# EAGLE design untitled (EAGLE 9.6.2)
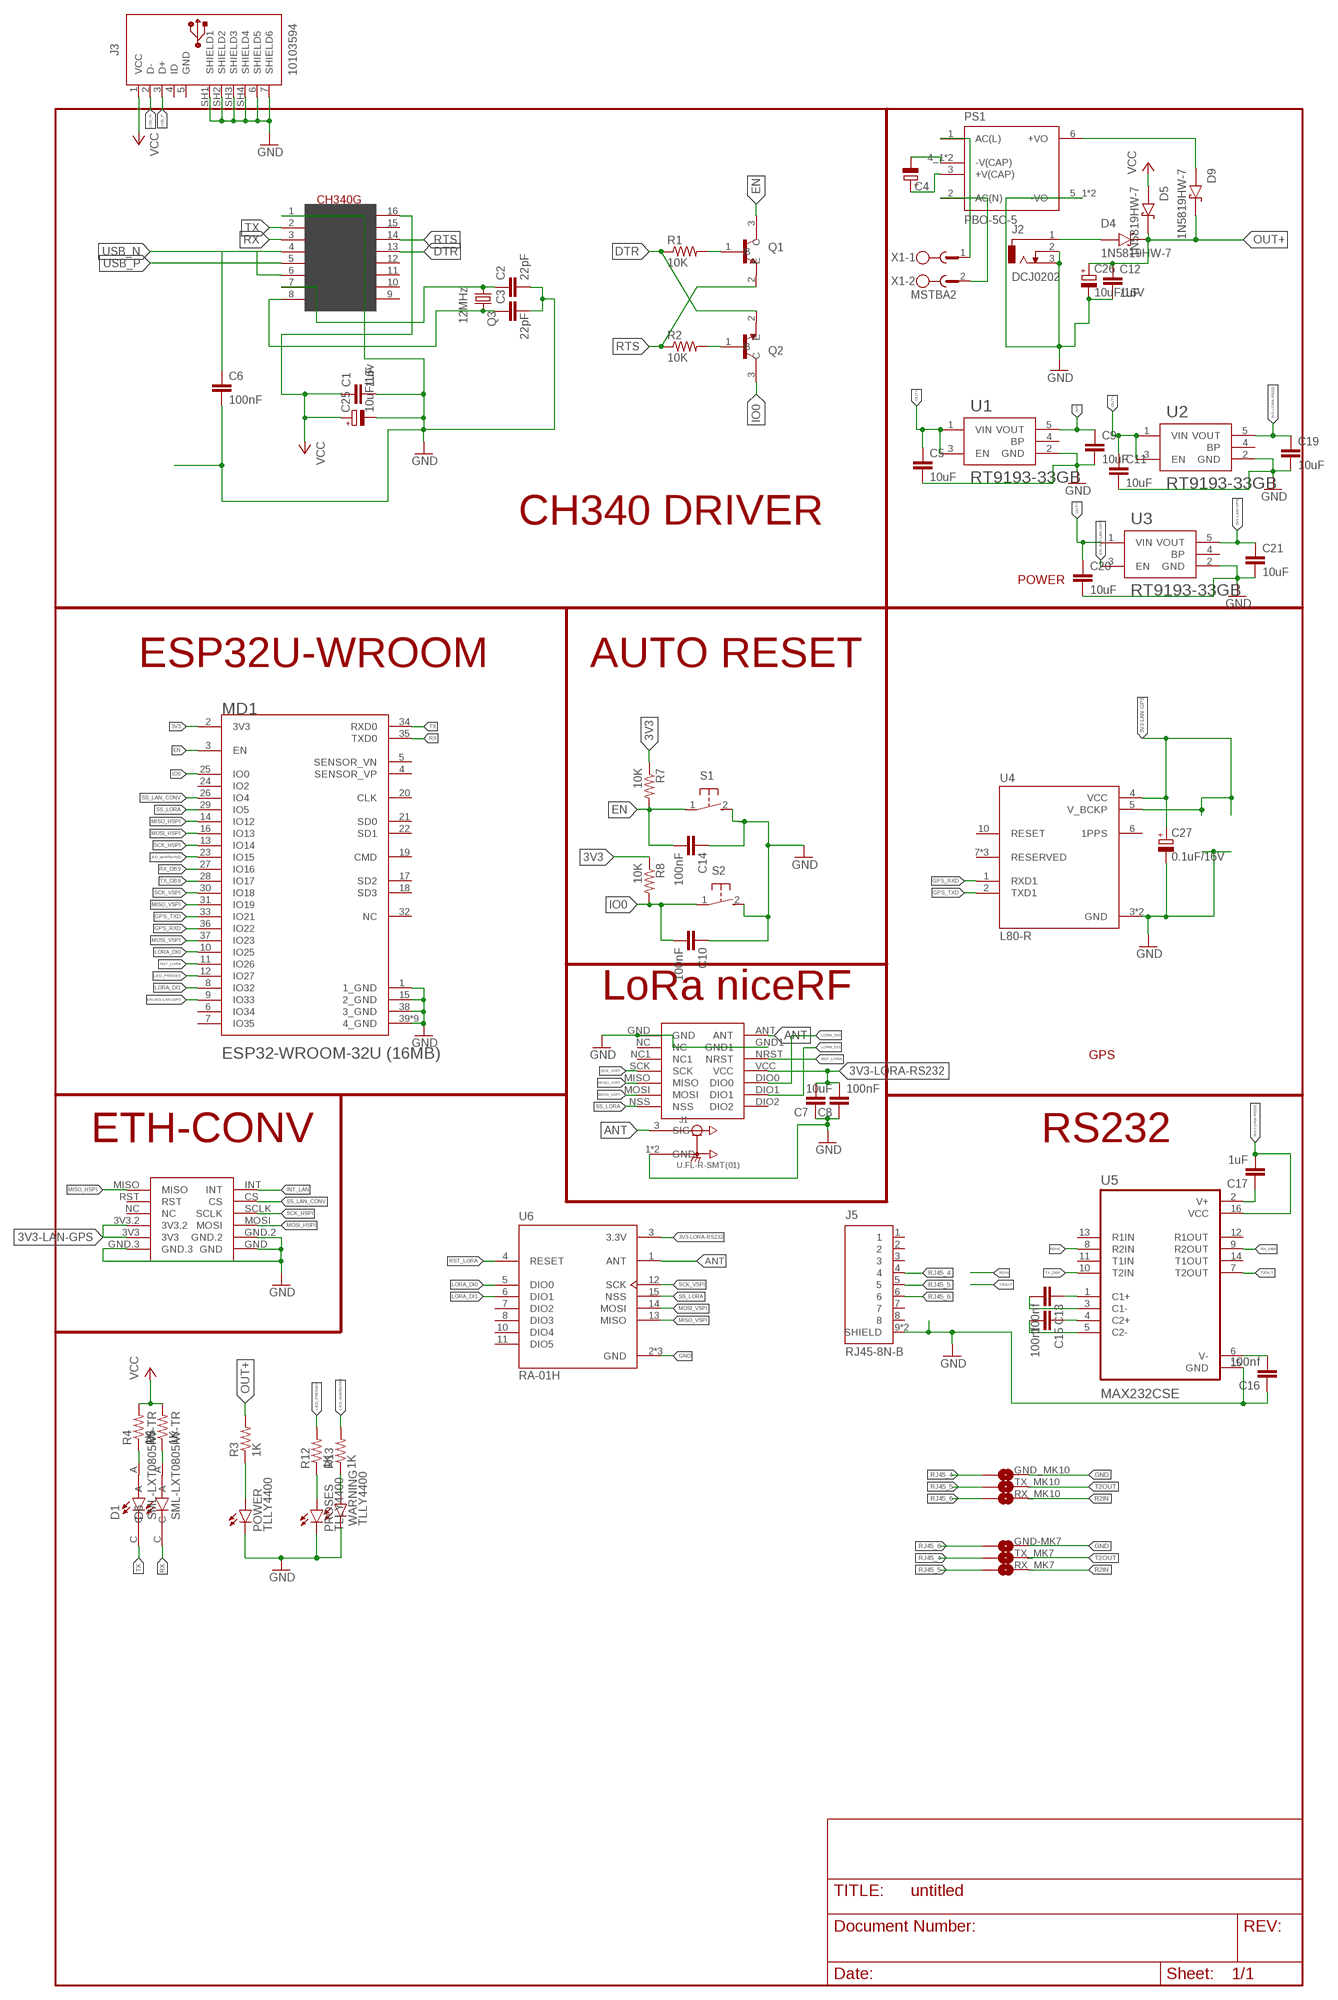
[diagram p0: schematic, sheet 1]

## Parts
C1  1uF  C-EUC0805K  [C0805K]
C2  22pF  C-EUC0805K  [C0805K]
C3  22pF  C-EUC0805K  [C0805K]
C4  CPOL-EUE2.5-7  [E2,5-7]
C5  10uF  C-EUC0805K  [C0805K]
C6  100nF  C-EUC0805K  [C0805K]
C7  10uF  C-EUC0805K  [C0805K]
C8  100nF  C-EUC0805K  [C0805K]
C9  10uF  C-EUC0805K  [C0805K]
C10  100nF  C-EUC0805K  [C0805K]
C11  10uF  C-EUC0805K  [C0805K]
C12  1uF  C-EUC0805K  [C0805K]
C13  100nf  C-EUC0805  [C0805]
C14  100nF  C-EUC0805K  [C0805K]
C15  100nf  C-EUC0805  [C0805]
C16  100nf  C-EUC0805  [C0805]
C17  1uF  C-EUC0805  [C0805]
C19  10uF  C-EUC0805K  [C0805K]
C20  10uF  C-EUC0805K  [C0805K]
C21  10uF  C-EUC0805K  [C0805K]
C25  10uF/16v  CPOL-EU153CLV-0505  [153CLV-0505]
C26  10uF/16V  CPOL-EU153CLV-0505  [153CLV-0505]
C27  0.1uF/16V  CPOL-EU153CLV-0505  [153CLV-0505]
D1  SML-LXT0805IW-TR  [LEDC2012X120N]
D4  1N5819HW-7  [SOD3715X145N]
D5  1N5819HW-7  [SOD3715X145N]
D6  SML-LXT0805IW-TR  [LEDC2012X120N]
D9  1N5819HW-7  [SOD3715X145N]
GND-MK7  1X02-SJ-NO  [1X02-SJ-NO]
GND_MK10  1X02-SJ-NO  [1X02-SJ-NO]
J1  U.FL-R-SMT(01)  [HRS_U.FL-R-SMT(01)]
J2  DCJ0202  [DCJ0202]
J3  10103594  [10103594]
J5  RJ45-8N-B  [TE_RJ45-8N-B]
LORA-NICERF-V1  LORA-NICERF-V2  [LORA-NICERF-V2]
MD1  ESPRESSIF_SYSTEMS_ESP32-WROOM-32U_16MBESPRESSIF_SYSTEMS_ESP32-WROOM-32U_16MB_0_0  [ESPRESSIF_SYSTEMS_ESP32-WROOM-32U_16MB_0]
POWER  TLLY4400  [LED3MM]
PROSES  TLLY4400  [LED3MM]
PS1  PBO-5C-5  [CONV_PBO-5C-5]
Q1  MMBT3904  [SOT95P240X120-3N]
Q2  MMBT3904  [SOT95P240X120-3N]
Q3  12MHz  CRYSTALSM49  [SM49]
R1  10K  R-US_M0805  [M0805]
R2  10K  R-US_M0805  [M0805]
R3  1K  R-US_M0805  [M0805]
R4  1K  R-US_M0805  [M0805]
R5  1K  R-US_M0805  [M0805]
R7  10K  R-US_M0805  [M0805]
R8  10K  R-US_M0805  [M0805]
R12  1K  R-US_M0805  [M0805]
R13  1K  R-US_M0805  [M0805]
RX_MK7  1X02-SJ-NO  [1X02-SJ-NO]
RX_MK10  1X02-SJ-NO  [1X02-SJ-NO]
S1  31-XX  [B3F-31XX]
S2  31-XX  [B3F-31XX]
TX_MK7  1X02-SJ-NO  [1X02-SJ-NO]
TX_MK10  1X02-SJ-NO  [1X02-SJ-NO]
U1  RT9193-33GB  [SOT94P279X129-5N]
U2  RT9193-33GB  [SOT94P279X129-5N]
U3  RT9193-33GB  [SOT94P279X129-5N]
U4  L80-R  [XCVR_L80-R]
U5  MAX232CSE  [SOIC127P600X175-16N]
U6  RA-01H  [XCVR_RA-01H]
U$2  CH340G  [SOIC16]
U$3  MINI_W5500  [MINI_W5500]
WARNING  TLLY4400  [LED3MM]
X1  MSTBA2  [MSTBA2]

## Nets
3V3: C9.1 MD1.2(3V3) R7.1 R8.1 U1.5(VOUT)
3V3-LAN-GPS: C21.1 C27.+ U3.5(VOUT) U4.4(VCC) U4.5(V_BCKP) U$3.3V3 U$3.3V3.2
3V3-LORA-RS232: C7.2 C8.2 C17.2 C19.1 LORA-NICERF-V1.VCC U2.5(VOUT) U5.16(VCC) U6.3(3.3V)
ANT: J1.3(SIG) LORA-NICERF-V1.ANT U6.1(ANT)
DTR: Q2.2(E) R1.1 U$2.13(DTR)
EN: C14.2 MD1.3(EN) Q1.3(C) R7.2 S1.1(P)
EN-3V3-LAN-GPS: MD1.9(IO33) U3.3(EN)
GND: C1.2 C2.2 C3.2 C5.2 C6.2 C7.1 C8.1 C9.2 C10.1 C11.2 C12.2 C14.1 C16.1 C19.2 C20.2 C21.2 C25.- C26.- C27.- GND-MK7.2 GND_MK10.2 J1.1(GND) J1.2(GND) J2.2 J2.3 J3.6(SHIELD5) J3.7(SHIELD6) J3.SH1(SHIELD1) J3.SH2(SHIELD2) J3.SH3(SHIELD3) J3.SH4(SHIELD4) J5.9(SHIELD) J5.10(SHIELD) LORA-NICERF-V1.GND LORA-NICERF-V1.GND1 MD1.1(1_GND) MD1.15(2_GND) MD1.38(3_GND) MD1.39(4_GND) MD1.39-2(4_GND) MD1.39-3(4_GND) MD1.39-4(4_GND) MD1.39-5(4_GND) MD1.39-6(4_GND) MD1.39-7(4_GND) MD1.39-8(4_GND) MD1.39-9(4_GND) POWER.K(C) PROSES.K(C) PS1.5_1(-VO) PS1.5_2(-VO) S1.2(S) S2.2(S) U1.2(GND) U2.2(GND) U3.2(GND) U4.3(GND) U4.12(GND) U5.15(GND) U6.2(GND) U6.9(GND) U6.16(GND) U$2.1(GND) U$3.GND U$3.GND.2 U$3.GND.3 WARNING.K(C)
GPS_RXD: MD1.36(IO22) U4.1(RXD1)
GPS_TXD: MD1.33(IO21) U4.2(TXD1)
INT_LAN: U$3.INT
IO0: C10.2 MD1.25(IO0) Q2.3(C) R8.2 S2.1(P)
LED_PROSES: MD1.12(IO27) R12.2
LED_WARNING: MD1.23(IO15) R13.2
LORA_DI0: LORA-NICERF-V1.DIO0 MD1.10(IO25) U6.5(DIO0)
LORA_DI1: LORA-NICERF-V1.DIO1 MD1.8(IO32) U6.6(DIO1)
MISO_HSPI: MD1.14(IO12) U$3.MISO
MISO_VSPI: LORA-NICERF-V1.MISO MD1.31(IO19) U6.13(MISO)
MOSI_HSPI: MD1.16(IO13) U$3.MOSI
MOSI_VSPI: LORA-NICERF-V1.MOSI MD1.37(IO23) U6.14(MOSI)
N$1: C2.1 Q3.1 U$2.7(XI)
N$2: C3.1 Q3.2 U$2.8(XO)
N$3: POWER.A R3.1
N$4: Q1.1(B) R1.2
N$5: Q2.1(B) R2.2
N$6: D4.A J2.1
N$7: C4.- PS1.4_1(-V(CAP)) PS1.4_2(-V(CAP))
N$8: D1.A R4.1
N$9: D6.A R5.1
N$10: C13.1 U5.1(C1+)
N$11: C4.+ PS1.3(+V(CAP))
N$12: C6.1 U$2.4(V3)
N$13: PS1.1(AC(L)) X1.1
N$14: C13.2 U5.3(C1-)
N$15: PS1.2(AC(N)) X1.2
N$16: D9.A PS1.6(+VO)
N$19: C15.1 U5.4(C2+)
N$24: C15.2 U5.5(C2-)
N$25: PROSES.A R12.1
N$26: C17.1 U5.2(V+)
N$27: C16.2 U5.6(V-)
N$28: R13.1 WARNING.A
OUT+: C5.1 C11.1 C12.1 C20.1 C26.+ D4.C(K) D5.C(K) D9.C(K) R3.2 U1.1(VIN) U1.3(EN) U2.1(VIN) U2.3(EN) U3.1(VIN)
R2IN: RX_MK7.2 RX_MK10.2 U5.8(R2IN)
RJ45_4: GND_MK10.1 J5.4 TX_MK7.1
RJ45_5: J5.5 RX_MK7.1 TX_MK10.1
RJ45_6: GND-MK7.1 J5.6 RX_MK10.1
RST_LORA: LORA-NICERF-V1.NRST MD1.11(IO26) U6.4(RESET)
RTS: Q1.2(E) R2.1 U$2.14(RTS)
RX: D6.C MD1.35(TXD0) U$2.3(RX)
RX_DB9: MD1.27(IO16) U5.9(R2OUT)
SCK_HSPI: MD1.13(IO14) U$3.SCLK
SCK_VSPI: LORA-NICERF-V1.SCK MD1.30(IO18) U6.12(SCK)
SS_LAN_CONV: MD1.26(IO4) U$3.CS
SS_LORA: LORA-NICERF-V1.NSS MD1.29(IO5) U6.15(NSS)
T2OUT: TX_MK7.2 TX_MK10.2 U5.7(T2OUT)
TX: D1.C MD1.34(RXD0) U$2.2(TX)
TX_DB9: MD1.28(IO17) U5.10(T2IN)
USB_N: J3.2(D-) U$2.6(D-)
USB_P: J3.3(D+) U$2.5(D+)
VCC: C1.1 C25.+ D5.A J3.1(VCC) R4.2 R5.2 U$2.16(VCC)
Unconnected: J3.4(ID) J5.1 J5.2 J5.3 J5.7 J5.8 LORA-NICERF-V1.DIO2 LORA-NICERF-V1.NC LORA-NICERF-V1.NC1 MD1.4(SENSOR_VP) MD1.5(SENSOR_VN) MD1.6(IO34) MD1.7(IO35) MD1.17(SD2) MD1.18(SD3) MD1.19(CMD) MD1.20(CLK) MD1.21(SD0) MD1.22(SD1) MD1.24(IO2) MD1.32(NC) U1.4(BP) U2.4(BP) U3.4(BP) U4.6(1PPS) U4.7(RESERVED) U4.8(RESERVED) U4.10(RESET) U4.11(RESERVED) U5.11(T1IN) U5.12(R1OUT) U5.13(R1IN) U5.14(T1OUT) U6.7(DIO2) U6.8(DIO3) U6.10(DIO4) U6.11(DIO5) U$2.9(CTS) U$2.10(DSR) U$2.11(RI) U$2.12(DCD) U$2.15(RS232) U$3.NC U$3.RST

## Notes on the sheet
- CH340 DRIVER
- POWER
- ESP32U-WROOM | AUTO RESET
- LoRa niceRF
- GPS
- ETH-CONV | RS232

## Power pins joined to a net without a drawn wire
GND: J3.5(GND)

## Library data of the parts
C1-C3 C5-C17 C19-C21 = rcl:C-EU: CAPACITOR, European symbol; SPICEPREFIX: C
C4 C25-C27 = rcl:CPOL-EU: POLARIZED CAPACITOR, European symbol; SPICEPREFIX: C
D1 D6 = SML-LXT0805IW-TR:SML-LXT0805IW-TR: LED; Luminous Intensity:11µcd; Viewing Angle:140°; Forward Current:30mA; Forward Voltage:2V; Color:Red; LED Color:Red; Leaded Process Compatible:Yes; Lens Color:White; Mounting Type:Surface Mount ;RoHS Compliant: Yes Check availability <https://pricing.snapeda.com/parts/SML-LXT0805IW-TR/Lumex%20Opto/Components/view-part?ref=eda>; AVAILABILITY: In Stock; DESCRIPTION: Red - LED Indication - Discrete 2V 0805 (2012 Metric); MF: Lumex Opto/Components; MP: SML-LXT0805IW-TR; PACKAGE: 0805 Lumex; PRICE: None; PURCHASE-URL: https://pricing.snapeda.com/search/part/SML-LXT0805IW-TR/?ref=eda
D4 D5 D9 = 1N5819HW-7:1N5819HW-7: 1N5819HW Series 40 V 1 A Surface Mount Schottky Barrier Rectifier - SOD-123 Check availability <https://pricing.snapeda.com/parts/1N5819HW-7/Diodes%20Inc./view-part?ref=eda>; AVAILABILITY: In Stock; DESCRIPTION: Diode Schottky 40 V 1A Surface Mount SOD-123; MF: Diodes Inc.; MP: 1N5819HW-7; PACKAGE: SOD-123 Fairchild Semiconductor; PRICE: None; PURCHASE-URL: https://pricing.snapeda.com/search/part/1N5819HW-7/?ref=eda
GND-MK7 GND_MK10 RX_MK7 RX_MK10 TX_MK7 TX_MK10 = Ai_Connectors:1X02-SJ-NO: A.I. Device 1x02-SJ-* NC has a large amount of paste (see paste layer) so that it should jumper during reflow. Remember that we have a version with a buil-in trace, which needs to be cut in order to have the jumper be NO.
J1 = U.FL-R-SMT_01_:U.FL-R-SMT(01): U.FL Series 6 Ghz 50 Ohm Ultra-small SMT Coaxial Cable Receptacle Check availability <https://pricing.snapeda.com/parts/U.FL-R-SMT%2801%29/Hirose/view-part?ref=eda>; AVAILABILITY: In Stock; DESCRIPTION: U.FL (UMCC) Connector Receptacle, Male Pin 50Ohm Surface Mount Solder. RF Connectors / Coaxial Connectors; MF: Hirose; MP: U.FL-R-SMT(01); PACKAGE: None; PRICE: None; PURCHASE-URL: https://pricing.snapeda.com/search/part/U.FL-R-SMT(01)/?ref=eda
J2 = con-jack:DCJ0202: DC POWER JACK Source: DCJ0202.pdf; OC_FARNELL: unknown; OC_NEWARK: unknown
J3 = Connector_USB:10103594: USB(2.0) Micro-B, RCPT, 5POS, SMD-THT-R/A Datasheet <https://cdn.amphenol-icc.com/media/wysiwyg/files/documentation/datasheet/inputoutput/io_usb_micro.pdf> Drawing <https://cdn.amphenol-icc.com/media/wysiwyg/files/drawing/10103594.pdf>; CATEGORY: Connectors; CONTACTS: 5; CURRENT-RATING: 1.8A; DESCRIPTION: CONN RCPT USB2.0 MICRO B SMD R/A; GENDER: Receptacle; MANUFACTURER: Amphenol ICC (FCI); MOUNT_TYPE: R/A; MPN: 10103594-0001LF; OPERATING_TEMPERATURE: -30°C ~ 80°C; PART_STATUS: ACTIVE; ROHS_COMPLIANT: COMPLIANT; SUB_CATEGORY: USB; TYPE: USB-micro B; VOLTAGE-RATING: 100VAC
J5 = RJ45-8N-B:RJ45-8N-B: RJ Jack / Signal Line EMI/RFI Filters 6 TERM LOW PROFILE BLOCK INDUCTOR 8 PIN Check availability <https://pricing.snapeda.com/parts/RJ45-8N-B/TE%20Connectivity/view-part?ref=eda>; AVAILABILITY: In Stock; DESCRIPTION: Jack Modular Connector 8p8c (RJ45, Ethernet) 90° Angle (Right) Unshielded -; MF: TE Connectivity; MP: RJ45-8N-B; PACKAGE: None; PRICE: None; PURCHASE-URL: https://pricing.snapeda.com/search/part/RJ45-8N-B/?ref=eda
LORA-NICERF-V1 = LORA-NICERF-V2:LORA-NICERF-V2
MD1 = Espressif Systems - ESP32-WROOM-32U (16MB):ESPRESSIF_SYSTEMS_ESP32-WROOM-32U_16MB: Bluetooth, WiFi 802.11b/g/n, Bluetooth v4.2 +EDR, Class 1, 2 and 3 Transceiver Module 2.4GHz ~ 2.5GHz Antenna Not Included, U.FL Surface Mount; AUTOMOTIVE: No; BANDWIDTH: 72MHz; CENTROID_NOT_SPECIFIED: No; DATASHEET: https://www.espressif.com/sites/default/files/documentation/esp32-wroom-32d_esp32-wroom-32u_datasheet_en.pdf; DATA_RATE: 150Mbits/s; DEVICE_CLASS_L1: Integrated Circuits (ICs); DEVICE_CLASS_L2: RF Semiconductors and Devices; DEVICE_CLASS_L3: Transceivers; DIGIKEY_DESCRIPTION: RX TXRX MODULE WIFI U.FL SMD; DIGIKEY_PART_NUMBER: 1904-1028-1-ND; FOOTPRINT_VARIANT_NAME_0: Recommended_Land_Pattern; HEIGHT: 3.35mm; INTERFACE: I2C,SPI,UART,Ethernet,I2S,Other; LEAD_FREE: Yes; MAX_FREQUENCY: 2484MHz; MAX_SUPPLY_VOLTAGE: 3.6V; MF: Espressif Systems; MFG_PACKAGE_IDENT: 0; MFG_PACKAGE_IDENT_DATE: 0; MFG_PACKAGE_IDENT_REV: 0; MIN_SUPPLY_VOLTAGE: 3V; MOUSER_PART_NUMBER: 356-ES32WROOM32U16MB; MPN: ESP32-WROOM-32U (16MB); NOMINAL_SUPPLY_CURRENT: 0.5A; NUMBER_OF_ADC_CHANNELS: 16; NUMBER_OF_GPIO: 26; PACKAGE: BT_MODULE; PREFIX: MD; ROHS: Yes; SENSITIVITY: -98dBm; TEMPERATURE_RANGE_HIGH: +85°C; TEMPERATURE_RANGE_LOW: -40°C; VERIFICATION_VERSION: 0.0.0.3
POWER PROSES WARNING = led:TLLY4400: Low Current (2mA) LED 3 mm Tinted Diffused Package color YELLOW Source: Data sheet <http://www.farnell.com/datasheets/391098.pdf>; MF: VISHAY SEMICONDUCTOR; OC_FARNELL: 1612439
PS1 = PBO-5C-5:PBO-5C-5: Check availability <https://pricing.snapeda.com/parts/PBO-5C-5/CUI/view-part?ref=eda>; AVAILABILITY: In Stock; CUI_PURCHASE_URL: https://www.cui.com/product/internal-ac-dc-power-supplies/board-mount/pbo-5c-series?utm_source=snapeda.com&utm_medium=referral&utm_campaign=snapedaBOM; DESCRIPTION: 5 W, 85 ~ 305 Vac Input, Single Output, Open Frame, Board Mount, Ac-Dc Power Supply; MF: CUI; MP: PBO-5C-5; PACKAGE: SIP-6 CUI; PRICE: None; PURCHASE-URL: https://pricing.snapeda.com/search/part/PBO-5C-5/?ref=eda
Q1 Q2 = MMBT3904:MMBT3904: MMBT3904 Series 40 V CE Breakdown 0.2 A NPN General Purpose Amplifier - SOT-23 Check availability <https://pricing.snapeda.com/parts/MMBT3904/STMicroelectronics/view-part?ref=eda>; AVAILABILITY: Not in stock; DESCRIPTION: SMD Transistor MMBT3904 SOT-23 SMD DIOTEC; MF: STMicroelectronics; MP: MMBT3904; PACKAGE: SOT-23 ON; PRICE: None
Q3 = adafruit:CRYSTAL: CRYSTAL; OC_FARNELL: unknown; OC_NEWARK: unknown
R1-R5 R7 R8 R12 R13 = adafruit:R-US_: RESISTOR, American symbol
S1 S2 = switch-omron:31-XX: OMRON SWITCH; MPN: B3F-3100; OC_FARNELL: 959704; OC_NEWARK: 36M3582
U1-U3 = RT9193-33GB:RT9193-33GB: RT9193 Series 300 mA 3.3 V Ultra-Low Noise Ultra-Fast CMOS LDO Regulator-SC-70-5 Check availability <https://pricing.snapeda.com/parts/RT9193-33GB/Richtek%20USA%20Inc./view-part?ref=eda>; AVAILABILITY: In Stock; DESCRIPTION: Linear Voltage Regulator IC Positive Fixed 1 Output 300mA SOT-23-5; MF: Richtek USA Inc.; MP: RT9193-33GB; PACKAGE: SOT-23-5 Richtek; PRICE: None; PURCHASE-URL: https://pricing.snapeda.com/search/part/RT9193-33GB/?ref=eda
U4 = L80-R:L80-R: Check availability <https://pricing.snapeda.com/parts/L80-R/Quectel/view-part?ref=eda>; AVAILABILITY: In Stock; DESCRIPTION: L80-R is an ultra compact GPS POT (Patch on Top) module with an embedded 15.0mm × 15.0mm × 4.0mm patch antenna; MF: Quectel; MP: L80-R; PACKAGE: None; PRICE: None
U5 = MAX232CSE:MAX232CSE: Check availability <https://pricing.snapeda.com/parts/MAX232CSE/Maxim%20Integrated/view-part?ref=eda>; AVAILABILITY: In Stock; DESCRIPTION: 2/2 Transceiver Full RS232 16-SOIC; MF: Maxim Integrated; MP: MAX232CSE; PACKAGE: SOIC-16 Maxim Integrated; PRICE: None; PURCHASE-URL: https://pricing.snapeda.com/search/part/MAX232CSE/?ref=eda
U6 = RA-01H:RA-01H: Ai-Thinker Lora Series Module Check availability <https://pricing.snapeda.com/parts/RA-01H/AI-Thinker/view-part?ref=eda>; AVAILABILITY: In Stock; DESCRIPTION: General ISM < 1GHz LoRa™ Transceiver Module 803MHz ~ 930MHz Antenna Not Included Surface Mount; MF: AI-Thinker; MP: RA-01H; PACKAGE: Package; PRICE: None; PURCHASE-URL: https://pricing.snapeda.com/search/part/RA-01H/?ref=eda
U$2 = usb-serial:CH340G
U$3 = ethernet-mikroavr:MINI_W5500: MINI ETHERNET W5500, CREATE BY MIKROAVR.COM
X1 = con-phoenix-508:MSTBA2: PHOENIX; MF: FARNELL; MPN: 1757242; OC_FARNELL: 3705171; OC_NEWARK: 71C4161

## Net classes
0 default: width 0.2 mm, clearance 0.15 mm

## Board
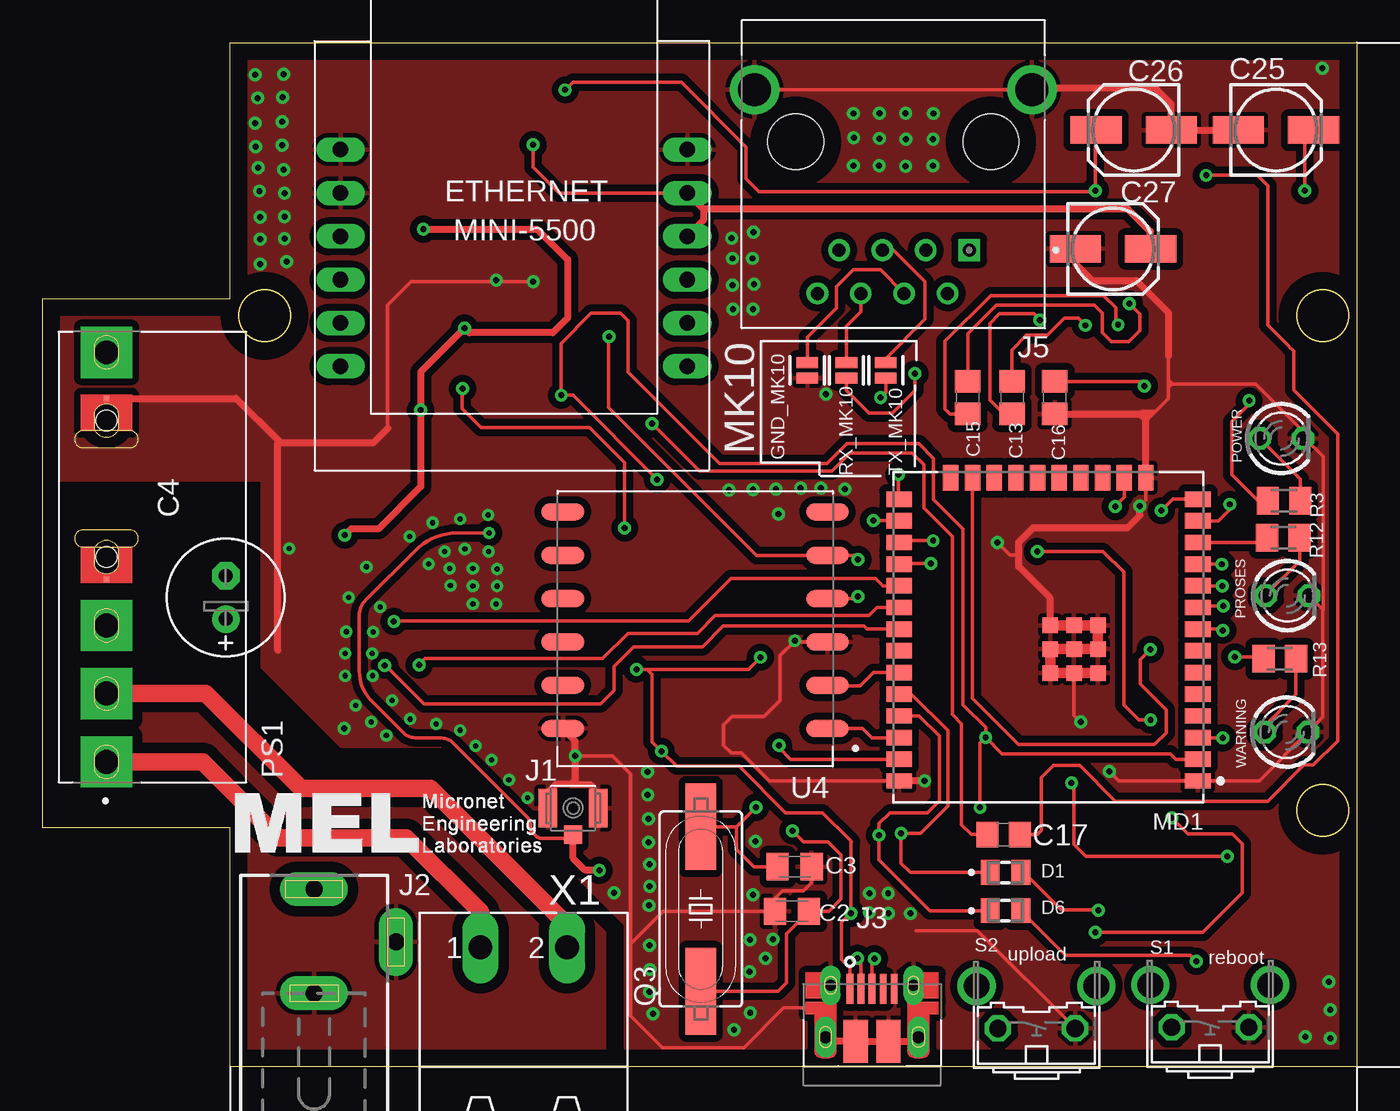
[diagram p1: board, top side]
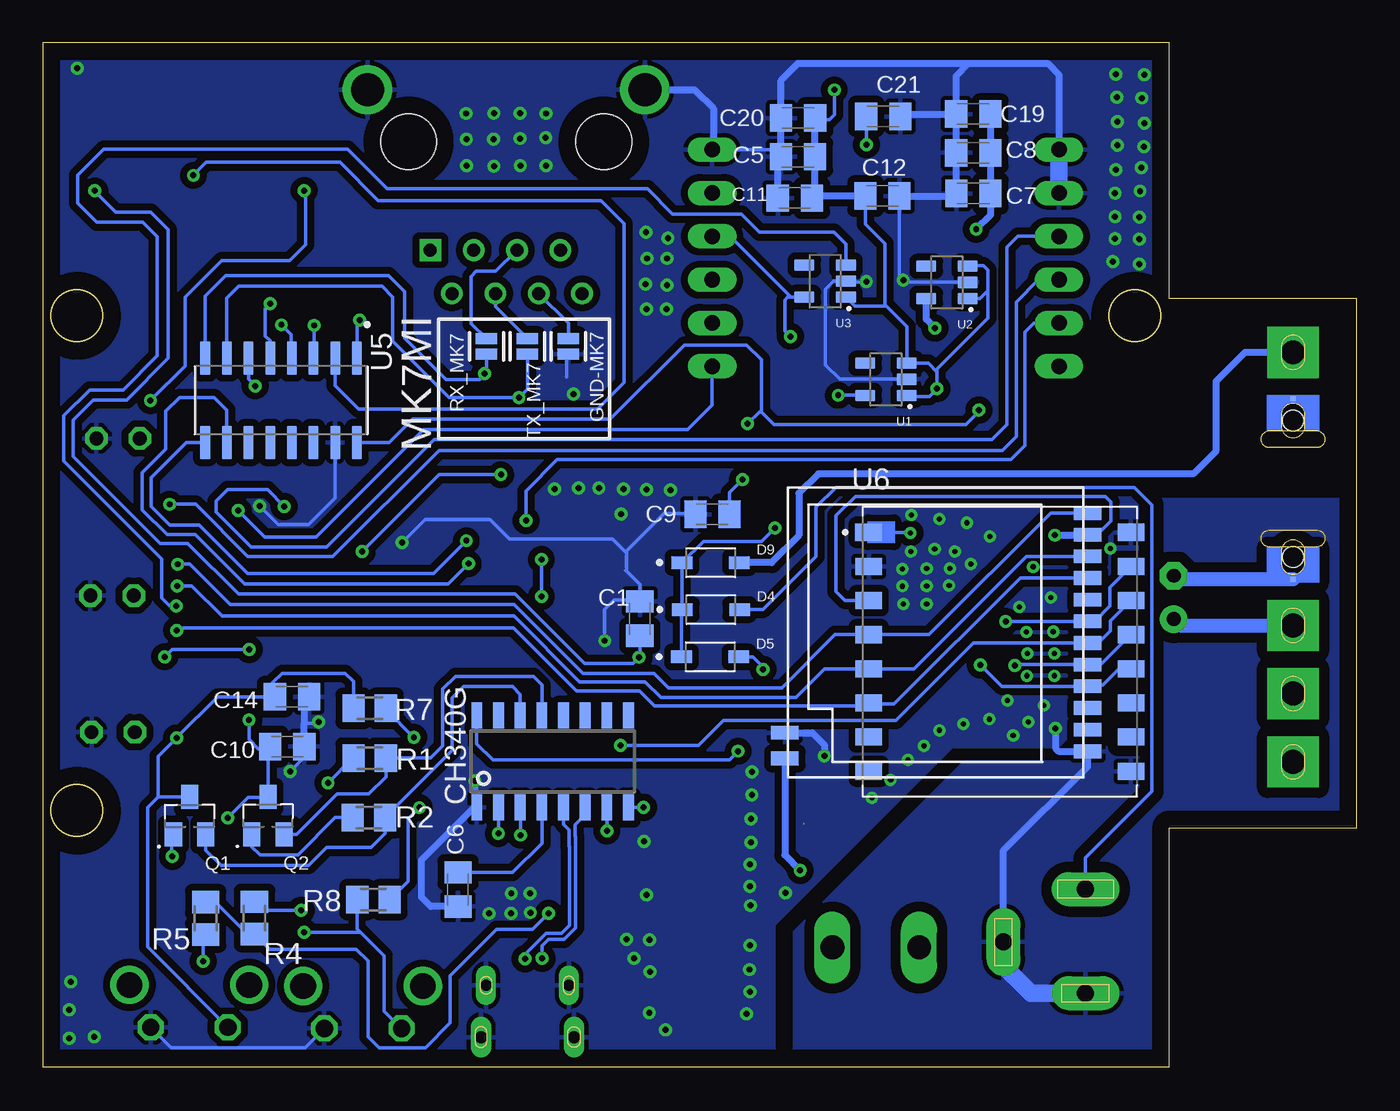
[diagram p2: board, bottom side, seen from below]

Size 77 x 60 mm. Coordinates in mm from the lower left corner, seen from the top.
Outline: 11,60 77,60 77,0 11,0 11,14 0,14 0,45 11,45 11,60
Outline: circle at 75,44 radius 1.5
Outline: circle at 13,44 radius 1.5
Outline: circle at 75,15 radius 1.5
Copper layers (1*16): Top 0.035mm / dielectric 1.5mm / Bottom 0.035mm
Design rules "default *": minimum track width 6mil, minimum drill 0.3mm, track to track 6mil, track to pad 6mil, pad to pad 6mil, via to via 6mil, smd to smd 6mil, copper to edge 40mil, drill to drill 6mil, minimum pad ring 10mil, minimum via ring 8mil, stop-mask expansion 4mil, vias tented up to drill 0mil, thermal gap 10mil

### Footprints (pad centres in the part's own frame; a part is rotated, then mirrored left to right if it is on the bottom)
C0805K = smd 1.3 x 1.6: 1 -1,0; 2 1,0
E2,5-7 = drill 0.813 pad 1.6: + -1.27,0 | drill 0.813 pad 1.6 octagon: - 1.27,0
C0805 = smd 1.3 x 1.5: 1 -0.95,0; 2 0.95,0
153CLV-0505 = smd 3 x 1.6: + 2.2,0; - -2.2,0
LEDC2012X120N = smd 1.1 x 1.45: A 0.9,0; C -0.9,0
SOD3715X145N = smd 1.21 x 0.73: A 1.68,0; C -1.68,0
1X02-SJ-NO = smd 0.635 x 1.27: 1 -0.45,0; 2 0.45,0
HRS_U.FL-R-SMT(01) = smd 1.1 x 2.25: 1 -1.475,0; 2 1.475,0 | smd 1.05 x 1.1: 3 0,-1.55
DCJ0202 = drill 1 pad 2 long: 1 0,3.1; 2 4.8,0; 3 0,-3
10103594 = smd 0.4 x 1.75: 1 -1.3,2.825; 2 -0.65,2.825; 3 0,2.825; 4 0.65,2.825; 5 1.3,2.825 | smd 1.425 x 2.5: 6 -0.963,-0.25; 7 0.963,-0.25 | drill 0.65 pad 0.73 long: SH1 -2.425,3.03; SH2 2.425,3.03 | drill 0.7 long: SH3 -2.725,0; SH4 2.725,0
TE_RJ45-8N-B = drill 0.76 square: 1 -4.445,6.35 | drill 0.76: 2 -3.175,8.89; 3 -1.905,6.35; 4 -0.635,8.89; 5 0.635,6.35; 6 1.905,8.89; 7 3.175,6.35; 8 4.445,8.89 | drill 1.93: 9 -8.125,-3.05; 10 8.125,-3.05 | hole 3.25: -5.715,0; 5.715,0
LORA-NICERF-V2 = smd 1.6 x 0.8: ANT 9.17,6.81; DIO0 -8.57,-5.03; DIO1 -8.57,-3.76; DIO2 -8.57,-2.49; GND -8.57,6.4; GND1 9.17,5.31; MISO -8.57,1.32; MOSI -8.57,0.05; NC -8.57,5.13; NC1 -8.57,3.86; NRST -8.57,-7.57; NSS -8.57,-1.22; SCK -8.57,2.59; VCC -8.57,-6.3
ESPRESSIF_SYSTEMS_ESP32-WROOM-32U_16MB_0 = smd 1.5 x 0.9: 1 -8.75,8.41; 2 -8.75,7.14; 3 -8.75,5.87; 4 -8.75,4.6; 5 -8.75,3.33; 6 -8.75,2.06; 7 -8.75,0.79; 8 -8.75,-0.48; 9 -8.75,-1.75; 10 -8.75,-3.02; 11 -8.75,-4.29; 12 -8.75,-5.56; 13 -8.75,-6.83; 14 -8.75,-8.1; 25 8.75,-8.1; 26 8.75,-6.83; 27 8.75,-5.56; 28 8.75,-4.29; 29 8.75,-3.02; 30 8.75,-1.75; 31 8.75,-0.48; 32 8.75,0.79; 33 8.75,2.06; 34 8.75,3.33; 35 8.75,4.6; 36 8.75,5.87; 37 8.75,7.14; 38 8.75,8.41 | smd 0.9 x 1.5: 15 -5.71,-9.35; 16 -4.44,-9.35; 17 -3.17,-9.35; 18 -1.9,-9.35; 19 -0.63,-9.35; 20 0.64,-9.35; 21 1.91,-9.35; 22 3.18,-9.35; 23 4.45,-9.35; 24 5.72,-9.35 | smd 0.9 x 0.9: 39 -2.9,2.09; 39-2 -1.5,0.69; 39-3 -1.5,2.09; 39-4 -0.1,2.09; 39-5 -0.1,-0.71; 39-6 -1.5,-0.71; 39-7 -2.9,-0.71; 39-8 -0.1,0.69; 39-9 -2.9,0.69
LED3MM = drill 0.813 octagon: A -1.27,0; K 1.27,0
CONV_PBO-5C-5 = drill 1.4 pad 3 square: 1 -12,0; 2 -8,0; 3 -4,0; 6 12,0 | smd 0.3 x 0.3: 4_1 -1.3,0; 5_1 9.3,0 | smd 0.3 x 0.3 bottom: 4_2 -1.3,0; 5_2 9.3,0 | hole 1.2: 0,0; 8,0
SOT95P240X120-3N = smd 1 x 1.4: 1 -0.95,-1.1; 2 0.95,-1.1; 3 0,1.1
SM49 = smd 5.08 x 1.778: 1 -4.826,0; 2 4.826,0
M0805 = smd 1.3 x 1.6: 1 -0.95,0; 2 0.95,0
B3F-31XX = drill 1.016 octagon: 1 -2.261,-1.245; 2 2.261,-1.245 | drill 1.499 pad 2.159: 3 -3.505,1.245; 4 3.505,1.245
SOT94P279X129-5N = smd 1.17 x 0.67: 1 -1.22,0.94; 2 -1.22,0; 3 -1.22,-0.94; 4 1.22,-0.94; 5 1.22,0.94
XCVR_L80-R = smd 2.5 x 1: 1 -7.75,6.35; 2 -7.75,3.81; 3 -7.75,1.27; 4 -7.75,-1.27; 5 -7.75,-3.81; 6 -7.75,-6.35; 7 7.75,-6.35; 8 7.75,-3.81; 9 7.75,-1.27; 10 7.75,1.27; 11 7.75,3.81; 12 7.75,6.35
SOIC127P600X175-16N = smd 1.97 x 0.59: 1 -2.475,4.445; 2 -2.475,3.175; 3 -2.475,1.905; 4 -2.475,0.635; 5 -2.475,-0.635; 6 -2.475,-1.905; 7 -2.475,-3.175; 8 -2.475,-4.445; 9 2.475,-4.445; 10 2.475,-3.175; 11 2.475,-1.905; 12 2.475,-0.635; 13 2.475,0.635; 14 2.475,1.905; 15 2.475,3.175; 16 2.475,4.445
XCVR_RA-01H = smd 1.536 x 1: 1 -7.682,7; 2 -7.682,5; 3 -7.682,3; 4 -7.682,1; 5 -7.682,-1; 6 -7.682,-3; 7 -7.682,-5; 8 -7.682,-7; 9 7.682,-7; 10 7.682,-5; 11 7.682,-3; 12 7.682,-1; 13 7.682,1; 14 7.682,3; 15 7.682,5; 16 7.682,7
SOIC16 = smd 0.635 x 1.524: 1 -4.445,-2.695; 2 -3.175,-2.695; 3 -1.905,-2.695; 4 -0.635,-2.695; 5 0.635,-2.695; 6 1.905,-2.695; 7 3.175,-2.695; 8 4.445,-2.695; 9 4.445,2.695; 10 3.175,2.695; 11 1.905,2.695; 12 0.635,2.695; 13 -0.635,2.695; 14 -1.905,2.695; 15 -3.175,2.695; 16 -4.445,2.695
MINI_W5500 = drill 0.914 long: 3V3 21.844,-8.89; 3V3.2 21.844,-11.43; CS 1.524,-16.51; GND 1.524,-6.35; GND.2 1.524,-8.89; GND.3 21.844,-6.35; INT 1.524,-19.05; MISO 21.844,-19.05; MOSI 1.524,-11.43; NC 21.844,-13.97; RST 21.844,-16.51; SCLK 1.524,-13.97
MSTBA2 = drill 1.397 long: 1 -2.54,5.08; 2 2.54,5.08

### Placement (x,y rotation side)
C1  42.01,26.25 90 bottom
C2  43.9,9.1 180 top
C3  44.06,11.71 0 top
C4  10.73,27.49 90 top
C5  32.75,53.32 180 bottom
C6  52.66,10.38 270 bottom
C7  22.46,51.16 0 bottom
C8  22.47,53.55 0 bottom
C9  37.76,32.36 180 bottom
C10  62.67,18.75 180 bottom
C11  32.93,50.89 180 bottom
C12  27.79,51.01 0 bottom
C13  56.8,39.2 90 top
C14  62.39,21.67 180 bottom
C15  54.2,39.2 90 top
C16  59.3,39.2 90 top
C17  56.3,13.6 180 top
C19  22.47,55.81 180 bottom
C20  32.74,55.59 180 bottom
C21  27.75,55.68 0 bottom
C25  72.26,54.88 0 top
C26  63.93,54.88 180 top
C27  62.71,47.92 0 top
D1  56.41,11.38 0 top
D4  37.85,26.78 0 bottom
D5  37.89,24.02 0 bottom
D6  56.42,9.14 0 top
D9  37.86,29.53 0 bottom
GND-MK7  46.2,42.2 270 bottom
GND_MK10  44.8,40.8 270 top
J1  31.08,15.14 0 top
J2  15.9,7.3 0 top
J3  48.6,1.73 0 top
J5  49.84,54.19 180 top
LORA-NICERF-V1  24.34,24.87 180 bottom
MD1  58.93,25.15 180 top
POWER  72.58,36.81 0 top
PROSES  72.93,27.6 0 top
PS1  3.74,29.86 90 top
Q1  68.39,14.7 0 bottom
Q2  63.8,14.7 0 bottom
Q3  38.56,9.23 90 top
R1  57.84,18.08 180 bottom
R2  57.88,14.59 180 bottom
R3  72.73,33.16 180 top
R4  64.59,8.71 270 bottom
R5  67.45,8.69 90 bottom
R7  57.84,20.99 180 bottom
R8  57.62,9.79 180 bottom
R12  72.69,30.98 180 top
R13  72.49,23.89 180 top
RX_MK7  51,42.2 270 bottom
RX_MK10  47.1,40.8 270 top
S1  68.41,3.55 0 top
S2  58.23,3.48 0 top
TX_MK7  48.6,42.2 270 bottom
TX_MK10  49.4,40.8 270 top
U1  27.59,40.27 180 bottom
U2  24.01,45.95 180 bottom
U3  31.15,46.02 180 bottom
U4  38.23,26.15 180 top
U5  63.03,39.04 270 bottom
U6  20.91,24.31 0 bottom
U$2  47.12,17.88 0 bottom
U$3  15.93,60.08 0 top
WARNING  72.87,19.6 0 top
X1  28.18,1.9 0 top

### Tracks (layer width: path | path; a pad name or v marks a point on that pad's centre or on a via)
3V3  (via drill 0.35)
  Top 0.2: v36.01,34.4 31.07,39.34 v30.39,39.34 30.37,39.36 30.37,42.37 32.14,44.14 33.86,44.14 34.3,43.7 34.3,40.69 39.65,35.34 45.97,35.34 47.13,36.5 51.33,36.5 52.2,35.64 52.2,33.24 53.92,31.51 53.92,21.19 55.25,19.86 v55.25,19.28 | MD1.2 66.39,18.01 66.08,18.32 56.22,18.32 v55.25,19.28 | v55.25,19.28 54.93,18.96 v54.93,15.18
  Bottom 0.2: 36.6,32.52 C9.1 36.76,33.65 v36.01,34.4 | v30.39,39.34 U1.5 | R7.1 56.89,20.92 v55.25,19.28 | R8.1 55.59,10.86 55.59,14.51 v54.93,15.18
3V3-LAN-GPS  (via drill 0.35)
  Top 0.2: U$3.3V3 30.24,51.19 28.74,52.7 v28.74,54.02 | v33.19,42.79 33.15,42.75 33.15,38.63 41.82,29.96 U4.5 47.52,29.96 v47.78,29.71 | U4.4 47.66,27.42 v47.78,27.55
  Top 0.406: 38.71,50.25 63.6,50.25 64.91,48.94 C27.+ 65.52,48.53 | 38.71,50.25 U$3.3V3 | 38.71,50.25 38.71,49.59 U$3.3V3.2
  Bottom 0.2: U$3.3V3.2 36.72,48.65 33.15,45.08 U3.5 33.35,45.08 33.51,44.92 33.51,43.11 v33.19,42.79 | v28.74,54.02 28.74,55.67 C21.1 | v47.78,27.55 v47.78,29.71
3V3-LORA-RS232  (via drill 0.35)
  Top 0.2: v35.69,37.67 38.48,34.89 46.23,34.89 47.3,35.95 50.94,35.95 51.62,35.27 51.62,32.72 53.29,31.05 53.29,20.63 53.83,20.09 53.83,14.17 54.4,13.6 C17.2
  Top 0.406: v22.31,49.07 28.98,49.07 30.76,47.29 30.76,43.87 29.89,43.01 24.99,43.01 v24.72,43.28 22.15,40.71 v22.15,38.47 22.15,33.98 19.68,31.52 18.08,31.52 v17.7,31.14
  Bottom 0.2: U5.16 56.69,36.57 55.33,37.93 43.74,37.93 39.38,42.29 35.76,42.29 34.89,41.42 34.89,38.36 | 34.89,38.36 34.15,37.62 22.92,37.62 22.07,38.47 v22.15,38.47 | v35.69,37.67 35.01,38.36 34.89,38.36 | LORA-NICERF-V1.VCC 15.2,31.17 14.4,31.97 14.4,33.09 14.73,33.42 29.39,33.42 30.51,32.3 30.51,27.83 29.99,27.31 U6.3
  Bottom 0.406: C19.1 | C19.1 C8.2 C7.2 21.46,49.91 v22.31,49.07 | v24.72,43.28 25.23,43.79 U2.5 | v17.7,31.14 15.81,31.14 LORA-NICERF-V1.VCC
ANT  (via drill 0.3, 0.35)
  Top 0.2: v26.16,31.27 24.3,31.27 arc45 21.85,30.26 18.93,27.33 arc45 18.55,26.43 18.55,23.17 arc45 19.28,21.42 21.09,19.6 arc45 21.92,19.26 23.28,19.26 arc-45 24.1,18.92 28.29,14.73 arc-45 28.6,14 28.6,13.96 arc45 28.7,13.71 28.87,13.54 arc45 29.3,13.36 30.52,13.36 arc45 J1.3
  Top 0.406: v32.62,11.51 31.79,11.51 31.08,12.22 J1.3
  Bottom 0.2: U6.1 26.25,31.31 arc45 v26.16,31.27
  Bottom 0.406: LORA-NICERF-V1.ANT 33.51,12.4 v32.62,11.51
DTR
  Bottom 0.2: Q2.2 62.11,13.6 59.74,15.97 57.9,15.97 56.89,16.98 R1.1 54.26,18.08 53.55,18.79 53.55,22.14 52.82,22.87 48.24,22.87 47.74,22.37 U$2.13
EN  (via drill 0.35)
  Top 0.2: v69.15,19.26 67.7,19.26 MD1.3
  Bottom 0.2: S1.1 70.86,7.01 70.86,15.19 70.23,15.81 | 70.23,15.81 Q1.3 | R7.2 58.79,22.56 59.27,23.05 62.98,23.05 63.52,22.51 63.52,21.67 | 70.23,15.81 70.23,18.18 v69.15,19.26 69.15,19.27 66.75,21.67 63.52,21.67 | 63.41,21.66 C14.2 63.52,21.67
EN-3V3-LAN-GPS  (via drill 0.35)
  Top 0.2: MD1.9 67.76,26.98 v69.18,26.98
  Bottom 0.2: v69.18,26.98 69.56,26.98 70.03,27.45 70.03,29.76 75.76,35.49 75.76,38.15 74.26,39.65 72.3,39.65 70.29,41.66 70.29,48.65 71.12,49.49 73.84,49.49 74.95,50.59 74.95,52.22 73.43,53.75 59.14,53.75 56.83,51.44 41.57,51.44 40.09,49.95 36.05,49.95 34.99,48.89 30.63,48.89 29.93,48.2 U3.3
GND  (via drill 0.3, 0.35)  (1 unrouted)
  Top 0.2: WARNING.K 74.8,20.26 | WARNING.K 71.28,16.74 MD1.1 63.06,16.74 v62.5,17.3 | C3.2 45.06,10.78 44.59,10.31 43.34,10.31 42.9,9.87 C2.2 36.36,9.1 34.45,7.19 | v64.29,32.85 64.64,33.2 MD1.15 | v28.75,45.99 26.58,45.99 | 26.58,45.99 v26.58,46.09 | v60.84,20.19 60.43,20.59 MD1.39-3 | 20.22,37.25 20.22,37.4 20.22,44.61 21.6,45.99 26.58,45.99 | 44.68,3.44 43.41,3.44 41.09,1.12 36.31,1.12 34.45,2.98 34.45,7.19 | 34.45,7.19 34.42,7.16 | 34.45,7.19 34.45,17.15 33.38,18.22 v31.21,18.22 | MD1.38 42.58,16.74 40.94,18.38 40.35,18.38 39.9,18.83 39.9,20.03 40.4,20.53 42.27,20.53 43.19,21.45 43.19,24.08 v44.06,24.96 44.14,24.88 U4.3 45.98,24.76 45.44,24.76 | S2.2 54.76,7.97 51.16,7.97 | 65.96,41.64 65.96,40.27 66.23,39.99 71.07,39.99 73.85,37.22 POWER.K 73.88,36.83 73.93,36.83 75.03,35.73 75.03,26.77 75.02,26.78 | v55.95,30.7 56.68,29.98 57.2,29.98 | PROSES.K 75.02,26.78 | WARNING.K 75.02,20.48 75.02,26.78 | J5.10 J5.9 | C16.1 59.79,38.25
  Top 0.203: 64.91,38.25 64.28,38.25 64.41,38.38 65.19,38.38 | 64.91,38.25 65.06,38.25 | 65.06,38.25 65.19,38.38 | 65.96,39.78 65.96,39.15 65.19,38.38 | 65.96,39.78 65.96,40.27 | 65.96,39.78 66.17,39.99 66.23,39.99 | 64.59,37.94 64.91,38.25 | 64.64,37.89 64.7,37.89 65.06,38.25
  Top 0.406: 30.41,19.87 U4.12 31.21,19.07 v31.21,18.22 31.21,16.79 30.95,16.53 | MD1.15 64.64,37.89 64.59,37.94 64.28,38.25 59.79,38.25 | C26.- C25.- 70.03,54.84 | C27.- 60.51,47.04 61.5,46.06 64.07,46.06 65.96,44.17 65.96,41.64 | C26.- 66.13,56.4 65.19,57.33 58.06,57.33 J5.9 | v51.68,16.73 MD1.38 | 44.68,3.44 44.8,3.56 45.49,3.56 46.02,3.03 | MD1.39-5 59.03,27.46 57.2,29.29 57.2,29.98 57.2,30.74 58.04,31.58 63.58,31.58 64.29,32.3 v64.29,32.85 | 66.06,54.81 C26.- | PS1.5_2 11.33,39.16 13.84,36.64 | 13.84,36.64 13.92,36.56 19.39,36.56 20.22,37.4 | 30.95,16.53 32.08,16.53 32.23,16.38 32.23,15.46 J1.2 | 29.79,15.33 J1.1 29.6,16.06 30.07,16.53 30.95,16.53 | 13.77,24.41 13.77,36.57 13.84,36.64 | J3.SH3 46.12,1.48 J3.6 J3.7 51.07,1.48 J3.SH4
  Top 0.61: MD1.39-5 MD1.39-6 MD1.39-7 MD1.39-9 MD1.39-2 MD1.39-8 MD1.39-4 MD1.39-3 MD1.39
  Bottom 0.2: S2.2 61.61,1.12 69.48,1.12 S1.2 | 22.82,45.98 U2.2 26.44,45.95 v26.58,46.09 26.79,46.31 C12.2 | U5.15 59.86,33.32 61.41,31.77 63.21,31.77 v64.29,32.85 | U$3.GND.3 37.7,53.73 34.17,53.73 C5.2 | U1.2 30.3,40.27 31.13,41.1 31.13,45.57 30.68,46.02 U3.2 29.87,45.96 28.77,45.96 v28.75,45.99 | 42.8,29.04 42.8,30.09 | 42.8,30.09 42.8,30.2 40.6,32.41 38.8,32.41 C9.2 | 42.84,29.08 42.8,29.04 | 42.8,29.04 42.01,28.25 C1.2 42.1,27.34 43.51,27.34 44.06,26.79 v44.06,24.96 | 61.67,20.11 60.91,20.11 v60.84,20.19 | v62.5,17.3 61.67,18.13 C10.1 | 42.8,30.09 43.61,30.9 49.65,30.9 50.8,32.05 54.6,32.05 v55.95,30.7 | GND-MK7.2 46.3,41.65 46.3,40.4
  Bottom 0.406: C6.2 54.26,9.38 54.8,9.92 54.8,12.1 51.72,15.19 U$2.1 51.68,15.3 v51.68,16.73 | LORA-NICERF-V1.GND1 31.91,19.56 31.21,18.86 v31.21,18.22 31.11,18.31 | LORA-NICERF-V1.GND 15.77,17.59 20.7,12.66 J2.2 | C11.2 33.93,53.14 C5.2 33.75,55.58 C20.2 33.74,57.8 32.75,58.78 22.75,58.78 | C19.2 C8.1 C7.1 23.61,51.01 C12.2 | C19.2 | C19.2 23.47,58.06 22.75,58.78 | 22.75,58.78 18.11,58.78 17.45,58.12 U$3.GND | C21.2 26.61,55.81 C19.2 | C10.1 61.67,20.11 61.67,21.4 C14.1 | J5.10 38.8,57.24 37.7,56.15 37.7,53.73 | LORA-NICERF-V1.GND 15.94,18.31 | v17.66,19.82 17.66,18.66 17.48,18.47 LORA-NICERF-V1.GND
  Bottom 1.016: U$3.GND.2 U$3.GND | J2.2 20.7,5.9 19.1,4.3 J2.3
  other vias: 35.43,17.26 35.45,15.92 35.5,14.52 35.49,13.13 35.55,11.85 35.57,10.57 35.52,9.44 35.55,7.1 35.59,5.69 35.55,4.38 35.76,3.09 41.46,3.16 40.51,2.16 41.41,5.55 41.45,7.44 41.61,10.06 41.76,13.2 12.45,58.12 14.13,58.15 14.06,56.79 14.03,55.36 14.03,54 14.13,52.57 14.16,51.17 14.16,49.81 14.16,48.52 14.3,47.16 12.59,56.76 12.45,55.29 12.49,53.9 12.63,52.67 12.7,51.31 12.73,49.78 12.73,48.48 12.73,47.02 48.43,9.02 49.54,8.99 50.84,8.97 48.44,10.15 49.54,10.16 42.35,6.35 42.8,7.46 40.21,33.79 41.63,33.81 42.96,33.83 44.41,33.9 45.61,33.9 47.01,33.85 41.65,48.9 41.59,47.36 41.68,45.85 41.62,44.39 40.46,44.39 40.43,45.79 40.43,47.36 40.37,48.55 74.96,58.5 47.51,52.79 49.01,52.79 50.56,52.77 52.17,52.79 52.18,54.34 50.58,54.34 49.02,54.39 47.52,54.43 47.52,55.85 49.02,55.86 50.56,55.86 52.2,55.85 43.12,32.39 75.45,1.65 75.45,3.33 75.36,4.97 73.98,1.74 33.47,10.17 45.9,39.4 14.44,30.37 25.21,27.1 26.63,28.15 23.89,28.19 26.58,27.1 23.85,29.18 22.61,29.45 25.21,28.17 25.21,29.2 26.63,29.16 23.55,30.19 24.74,30.33 26.12,30.19 19.78,26.94 19.36,25.46 19.31,24.2 19.33,22.9 20.48,21.46 21.53,20.36 23.06,20.07 24.45,19.71 25.37,18.79 26.31,17.96 27.32,16.79 28.42,15.74 26.11,32.32 24.47,32.08 22.84,31.87 21.51,31.07 17.92,27.48 17.79,25.48 17.72,24.2 17.72,22.9 18.33,21.17 19.25,20.2 20.14,19.4 18.97,29.29
  pour Top (isolate 0.406): 0,34.3 12.8,34.3 12.8,23.4 17.5,18.7 23.7,18.7 34.1,8.3 34.1,0 77,0 77,60 11,60 11,45 0,45
  pour Top (isolate 0.61): 0,14 11,14 11,0 33,0 33,7.9 23,17.9 16.7,17.9 11.9,22.7 11.9,33.3 0,33.3
  pour Bottom (isolate 0.61): 0,33.3 0,14 11,14 11,0 33,0 33,7.9 23,17.9 16.7,17.9 11.9,22.7 11.9,33.3
  pour Bottom (isolate 0.406): 0,34.3 12.8,34.3 12.8,23.4 17.5,18.7 23.7,18.7 34.1,8.3 34.1,0 77,0 77,60 11,60 11,45 0,45
GPS_RXD
  Top 0.2: U4.1 48.05,19.8 48.6,19.25 50.15,19.25 MD1.36
GPS_TXD
  Top 0.2: MD1.33 48.68,23.09 47.89,22.29 46.03,22.29 U4.2
IO0  (via drill 0.35)
  Top 0.2: v64.92,20.3 64.21,20.3 63.34,21.18 63.34,28.98 62.13,30.19 v58.27,30.19 | v61.69,7.87 67.98,7.87 70.3,10.19 70.3,13.04 69.69,13.65 67.09,13.65 v66.15,14.59 | v50.15,34.68 50.15,33.28 MD1.25
  Bottom 0.2: S2.1 56.99,3.25 56.99,6.5 58.36,7.87 | 63.8,18.62 Q2.3 63.82,15.78 64.95,15.78 v66.15,14.59 | 63.8,18.62 C10.2 | v64.92,20.3 64.92,19.17 64.36,18.62 63.8,18.62 | v61.69,7.87 58.36,7.87 | R8.2 58.57,8.08 58.36,7.87 | v58.27,30.19 53.78,34.68 v50.15,34.68
LED_PROSES
  Top 0.2: MD1.12 71.47,30.71 R12.2
LED_WARNING  (via drill 0.35)
  Top 0.2: MD1.23 54.48,21.58 57.18,18.88 65.15,18.88 65.83,19.57 65.83,20.89 64.31,22.41 64.31,23.85 v64.9,24.44 | R13.2 71.42,24.01 v69.85,24.01
  Bottom 0.2: v64.9,24.44 69.42,24.44 v69.85,24.01
LORA_DI0  (via drill 0.35)
  Top 0.2: 67.65,28.14 MD1.10 v69.12,28.17
  Bottom 0.2: LORA-NICERF-V1.DIO0 19.36,29.9 25.96,23.31 U6.5 31.18,23.31 32.87,21.62 40.77,21.62 41.7,22.54 45.53,22.54 49.38,26.39 66.5,26.39 68.27,28.17 v69.12,28.17
LORA_DI1  (via drill 0.35)
  Top 0.2: MD1.8 69.09,25.63 v69.15,25.56
  Bottom 0.2: LORA-NICERF-V1.DIO1 19.72,28.63 27.12,21.24 28.52,21.24 U6.6 28.59,21.15 28.61,21.13 41.15,21.13 42.04,22.01 45.73,22.01 49.41,25.7 69.02,25.7 v69.15,25.56
MISO_HSPI  (via drill 0.35)
  Top 0.2: v65.54,32.58 66.22,33.25 MD1.14
  Bottom 0.2: U$3.MISO 37.77,38.77 39.2,37.34 54.67,37.34 60.98,31.03 64,31.03 v65.54,32.58
MISO_VSPI  (via drill 0.35)
  Top 0.2: MD1.31 48.3,25.63 48.13,25.81 39.87,25.81 38.66,24.6 34.62,24.6 33.48,23.46 33.48,22.05 32.69,21.26 22.34,21.26 20.08,23.52 v20.03,23.52
  Bottom 0.2: v20.03,23.52 19.99,23.55 LORA-NICERF-V1.MISO 14.99,23.55 U6.13
MOSI_HSPI  (via drill 0.35)
  Top 0.2: MD1.16 63.37,33.37 62.84,32.84 v62.84,32.82
  Bottom 0.2: v62.84,32.82 63.83,33.81 66.15,33.81 66.82,33.13 66.82,32.49 64.78,30.45 60.35,30.45 54.08,36.73 21.39,36.73 20.49,37.63 20.49,48.02 19.86,48.65 U$3.MOSI
MOSI_VSPI  (via drill 0.35)
  Top 0.2: MD1.37 43.82,18.01 43.13,18.7 v43.13,18.81
  Bottom 0.2: v43.13,18.81 38.59,18.81 37.11,20.29 27.01,20.29 22.47,24.82 LORA-NICERF-V1.MOSI 15.15,24.82 14.44,25.54 14.44,26.1 U6.14
N$1  (via drill 0.35)
  Top 0.2: Q3.1 43.08,4.41 43.59,4.92 43.59,7.79 C2.1 46.06,9.1 46.78,9.82 46.78,12.42 46.02,13.18 44.57,13.18 v43.95,13.8
  Bottom 0.2: v43.95,13.8 v43.94,13.81 U$2.7
N$2  (via drill 0.35)
  Top 0.2: Q3.2 40.65,14.06 | 40.65,14.06 v41.78,15.19 | C3.1 41.66,11.71 40.65,12.72 40.65,14.06
  Bottom 0.2: v41.78,15.19 U$2.8
N$3
  Top 0.2: R3.1 73.68,34.44 POWER.A
N$4  (via drill 0.35)
  Top 0.2: v69.4,12.32 61.13,12.32 60.42,13.03 60.42,16.5 v60.29,16.63
  Bottom 0.2: Q1.1 69.43,13.51 69.43,12.32 v69.4,12.32 | v60.29,16.63 58.84,18.08 R1.2
N$5
  Bottom 0.2: Q2.1 64.75,12.88 64.27,12.4 62.04,12.4 59.85,14.59 R2.2
N$6
  Bottom 0.2: J2.1 15.9,12.24 12.02,16.12 12.02,32.92 13.04,33.93 30.53,33.93 31.68,32.78 31.68,29.88 34.78,26.78 D4.A
N$7  (1 unrouted)
  Bottom 0.813: PS1.4_1 10.52,28.56 C4.-
N$8  (via drill 0.35)
  Top 0.2: D1.A 57.5,11.38 59.7,9.18 61.83,9.18 v61.86,9.16
  Bottom 0.2: R4.1 64.08,9.16 v61.86,9.16
N$9  (via drill 0.35)
  Top 0.2: D6.A 59.93,6.52 67.23,6.52 v67.59,6.16
  Bottom 0.2: R5.1 67.59,7.6 v67.59,6.16
N$10  (via drill 0.35)
  Top 0.2: v58.43,43.75 58.06,44.12 56.07,44.12 55.5,43.55 55.5,39.05 56.55,38 C13.1
  Bottom 0.2: v58.43,43.75 58.59,43.6 U5.1
N$11
  Bottom 0.813: C4.+ 10.36,25.86 PS1.3
N$12
  Bottom 0.2: C6.1 49.46,11.38 47.75,13.09 U$2.4
N$13
  Top 1.016: X1.1 25.64,9.07 21.3,13.41 13.82,13.41 9.38,17.85 PS1.1
N$14  (via drill 0.35)
  Top 0.2: v61.09,43.44 60.68,43.85 59.88,43.85 58.88,42.85 57.65,42.85 56.8,42 C13.2
  Bottom 0.2: v61.09,43.44 61.09,41.56 U5.3
N$15
  Top 1.016: X1.2 30.73,8.31 22.74,16.3 15.13,16.3 9.55,21.88 3.76,21.88 PS1.2
N$16
  Bottom 0.406: PS1.6 6.55,41.86 8.24,40.16 8.24,36.08 9.59,34.74 31.55,34.74 32.69,33.6 32.69,31.13 34.28,29.53 D9.A
N$19  (via drill 0.35)
  Top 0.2: v63.01,43.47 62.88,43.6 62.88,44.46 62.16,45.18 55.55,45.18 52.86,42.5 52.86,38.54 53.15,38.25 C15.1
  Bottom 0.2: v63.01,43.47 62.43,42.89 62.43,41.55 U5.4
N$24  (via drill 0.35)
  Top 0.2: v63.67,44.7 64.28,44.09 64.28,43.12 63.64,42.49 62.61,42.49 62.09,43.01 62.09,44.17 61.62,44.63 55.87,44.63 54.2,42.96 C15.2
  Bottom 0.2: v63.67,44.7 63.96,44.41 63.96,42.82 63.67,42.53 U5.5
N$25
  Top 0.2: PROSES.A 71.66,27.65 73.64,29.64 R12.1
N$26  (via drill 0.35)
  Top 0.2: v68.17,52.22 71.17,52.22 71.78,51.62 71.78,43.46 73,42.23 73.11,42.11 73.23,42 73.3,41.94 73.3,39.64 75.88,37.06 75.88,19.09 74.46,17.67 73.89,17.67 71.78,15.55 62.86,15.55 60.77,17.65 59.21,17.65 58.5,16.94 58.5,13.83 58.27,13.6 C17.1
  Bottom 0.2: v68.17,52.22 67.41,52.98 59.58,52.98 57.35,50.75 44.27,50.75 42.93,49.41 42.93,40.08 44.49,38.52 58.49,38.52 59.86,39.89 U5.2
N$27  (via drill 0.35)
  Top 0.2: C16.2 64.28,40.15 v64.54,39.89
  Bottom 0.2: v64.54,39.89 64.94,40.28 U5.6
N$28
  Top 0.2: R13.1 73.44,21.8 71.57,19.94 71.57,19.63 WARNING.A
OUT+  (via drill 0.35)
  Top 0.2: v34.1,31.57 34.1,35.39 32.04,37.45 25.68,37.45 24.58,38.56 24.58,39.76 24.6,39.75 v24.6,39.73 | R3.2 71.2,33.16 69.66,34.7 69.66,37.8 70.69,38.83 v70.69,39.02 | C26.+ 61.68,54.83 v61.68,51.34 61.62,51.28 60.31,51.28 41.96,51.28 41.22,52.02 41.22,53.87 37.42,57.67 31.06,57.67 v30.62,57.23
  Bottom 0.2: U2.1 22.08,45.01 21.62,45.47 | 21.62,45.47 21.62,46.67 21.88,46.92 22.76,46.92 U2.3 | U1.3 26.35,41.21 | 26.35,41.21 25.1,41.21 24.6,40.71 | 24.6,40.71 v24.6,39.73 25.06,39.27 26.3,39.27 U1.1 | 24.6,40.71 24.6,40.88 21.62,43.86 21.62,45.47 | U3.1 29.41,44.56 27.66,44.56 | 26.35,41.21 26.35,43.35 27.56,44.56 27.66,44.56 | 27.66,44.56 27.66,48.23 28.79,49.36 C12.1 | D5.C 39.57,26.74 D4.C 39.53,29.52 | v34.1,31.57 34.89,30.78 38.29,30.78 39.53,29.54 39.53,29.52 | v70.69,39.02 68.66,41.05 68.66,45.09 66.52,47.23 62.52,47.23 61.6,48.15 61.6,51.26 v61.68,51.34 | v30.62,57.23 30.62,55.78 30.91,55.49 31.72,55.49 31.75,55.52 | 39.53,29.52 D9.C
  Bottom 0.406: 31.86,50.95 31.75,51.07 C5.1 31.75,55.52 31.75,55.58 C20.1 | 31.86,50.95 31.82,50.91 31.73,51.01 C12.1 | C11.1 31.86,50.95
R2IN  (via drill 0.35)
  Top 0.2: v51.1,40.6 51.1,39.6 49.8,38.3 48.4,38.3 47.1,39.6 RX_MK10.2
  Bottom 0.2: U5.8 67.48,45.14 66.27,46.36 56.74,46.36 55.8,45.42 55.8,42.7 53.35,40.25 51.4,40.25 51.1,40.55 v51.1,40.6 51,40.6 RX_MK7.2
RJ45_4
  Top 0.2: GND_MK10.1 44.8,42.75 46.5,44.45 46.5,45.7 47.5,46.7 49.08,46.7 J5.4
  Bottom 0.2: J5.4 50.48,44.53 TX_MK7.1
RJ45_5
  Top 0.2: J5.5 49.86,47.84 51.7,46 51.7,43.8 49.4,41.5 TX_MK10.1
  Bottom 0.2: J5.5 50.45,46.6 51.6,46.6 51.9,46.3 51.9,43.55 RX_MK7.1
RJ45_6
  Top 0.2: J5.6 47.94,44.24 47.1,43.4 RX_MK10.1
  Bottom 0.2: J5.6 46.2,43.57 GND-MK7.1
RST_LORA  (via drill 0.35)
  Top 0.2: MD1.11 v69.08,29.44
  Bottom 0.2: LORA-NICERF-V1.NRST 17.93,32.44 25.06,25.31 U6.4 | v69.08,29.44 68.38,29.44 66.01,27.07 49.37,27.07 48.14,25.84 45.34,23.03 41.18,23.03 40.34,22.2 33.68,22.2 30.57,25.31 U6.4 | U6.4 29.37,25.31
RTS
  Bottom 0.2: Q1.2 67.44,12.67 66.55,11.78 61.42,11.78 60.35,12.86 57.76,12.86 56.93,13.68 R2.1 | R2.1 | R2.1 53,18.52 53,21.61 52.35,22.27 49.47,22.27 49.02,21.82 U$2.14
RX  (via drill 0.35)
  Top 0.2: D6.C 51.99,9.13 49.01,12.11 v49.01,13.56 49.01,14.25 49.64,14.88 51.85,14.88 52.53,15.56 52.53,19.38 51.35,20.56 MD1.35
  Bottom 0.2: v49.01,13.56 49.01,15.17 U$2.3
RX_DB9  (via drill 0.35)
  Top 0.2: v52.18,30.81 50.28,30.81 MD1.27
  Bottom 0.2: U5.9 68.6,36.57 70.64,34.52 70.64,32.82 69.57,31.75 67.84,31.75 64.99,28.9 54.09,28.9 v52.18,30.81
SCK_HSPI  (via drill 0.35)
  Top 0.2: v69.56,32.95 69.56,32.65 68.89,31.98 MD1.13
  Bottom 0.2: v69.56,32.95 68.03,32.95 64.98,29.9 60,29.9 53.78,36.11 20.75,36.11 19.96,36.91 19.96,44.81 18.65,46.11 U$3.SCLK
SCK_VSPI  (via drill 0.35)
  Top 0.2: v22.06,23.54 22.42,23.9 32.82,23.9 34.31,25.39 38.35,25.39 39.4,26.44 48.42,26.44 48.89,26.9 MD1.30
  Bottom 0.2: v22.06,23.54 20.8,22.28 LORA-NICERF-V1.SCK 15.7,22.35 14.89,22.35 13.93,23.31 U6.12
SS_LAN_CONV  (via drill 0.35)
  Top 0.2: MD1.26 50.16,32 v48.67,32
  Bottom 0.2: U$3.CS 18.93,43.57 19.45,43.05 19.45,36.39 20.28,35.56 46.85,35.56 48.67,33.73 v48.67,32
SS_LORA  (via drill 0.35)
  Top 0.2: v20.57,26.08 20.61,26.12 37.83,26.12 40.33,28.61 48.8,28.61 49.24,28.17 MD1.29
  Bottom 0.2: v20.57,26.08 20.57,26.09 LORA-NICERF-V1.NSS 15.36,26.09 14.48,26.98 14.48,28.06 U6.15
T2OUT  (via drill 0.35)
  Top 0.2: TX_MK10.2 49.4,39.5 v49.1,39.2
  Bottom 0.2: U5.7 66.21,45.03 65.51,45.72 57.12,45.72 56.5,45.1 56.5,42.5 53.2,39.2 v49.1,39.2 48.6,39.7 TX_MK7.2
TX  (via drill 0.35)
  Top 0.2: D1.C 50.83,11.38 50.3,11.91 v50.3,13.67 | 50.3,13.38 v50.3,13.67 | MD1.34 50.92,21.82 53.05,19.69 53.05,15.28 51.44,13.67 v50.3,13.67
  Bottom 0.2: v50.3,13.67 v50.29,13.68 U$2.2
TX_DB9  (via drill 0.35)
  Top 0.2: v52.05,29.47 50.21,29.47 MD1.28
  Bottom 0.2: U5.10 66.21,38.46 66.96,39.21 68.98,39.21 69.78,38.41 69.78,36.19 71.15,34.81 71.15,32.62 69.71,31.18 68.05,31.18 65.16,28.28 53.24,28.28 v52.05,29.47
USB_N  (via drill 0.35)
  Top 0.203: J3.2 47.95,6.15 v47.75,6.35
  Bottom 0.203: v47.75,6.35 47.75,7.07 47.37,7.45 46.61,7.45 | 46.61,7.45 | 46.61,7.45 46.46,7.45 45.79,8.12 45.79,13.5 45.79,14.16 45.21,14.74 U$2.6
USB_P  (via drill 0.35)
  Top 0.203: J3.3 48.59,6.17 v48.74,6.31
  Bottom 0.203: v48.74,6.31 48.74,6.58 47.52,7.8 46.61,7.8 46.14,8.27 46.14,12.89 46.15,12.9 46.15,13.87 46.48,14.2 U$2.5
VCC  (via drill 0.35)
  Top 0.2: v42.05,23.99 41.34,23.28 v34.78,23.28 35.4,23.28 35.7,22.98 35.7,19.03 v36.25,18.48 37.13,17.6 40.8,17.6 43.53,14.88 45.69,14.88 47.26,13.31 47.39,13.18 | C25.+ 73.95,54.36 v73.95,51.32
  Top 0.203: 47.39,8.95 v47.35,8.99 | 47.38,8.95 v47.35,8.99 | J3.1 47.3,5.79 46.81,6.27 46.81,8.44 v47.35,8.99 | v47.35,8.99 47.35,13.21 47.26,13.31
  Bottom 0.2: 51.57,6.88 53.12,5.32 53.12,2.57 54.58,1.12 57.29,1.12 57.93,1.76 57.93,6.2 58.62,6.89 63.71,6.89 R4.2 64.98,7.76 66.86,9.64 R5.2 | D5.A 35.37,24.02 34.78,23.43 v34.78,23.28 | C1.1 42.01,24.03 v42.05,23.99 42.42,23.62 45.25,23.62 49.32,27.69 65.52,27.69 68.5,30.66 70.12,30.66 75.22,35.76 75.22,37.88 74.03,39.07 72.07,39.07 69.64,41.5 69.64,49.04 70.66,50.07 72.73,50.07 73.95,51.29 v73.95,51.32 | U$2.16 51.56,18.92 50.61,17.96 36.76,17.96 v36.25,18.48
  Bottom 0.203: 51.57,6.88 50.4,8.04 48.3,8.04 v47.35,8.99

### Text on the board
tNames: MK10 | upload | reboot
bNames: MK7MI